# Altium schematic sheet Main PCB.SchDoc
size A4; SheetNumber: 1; SheetTotal: 7
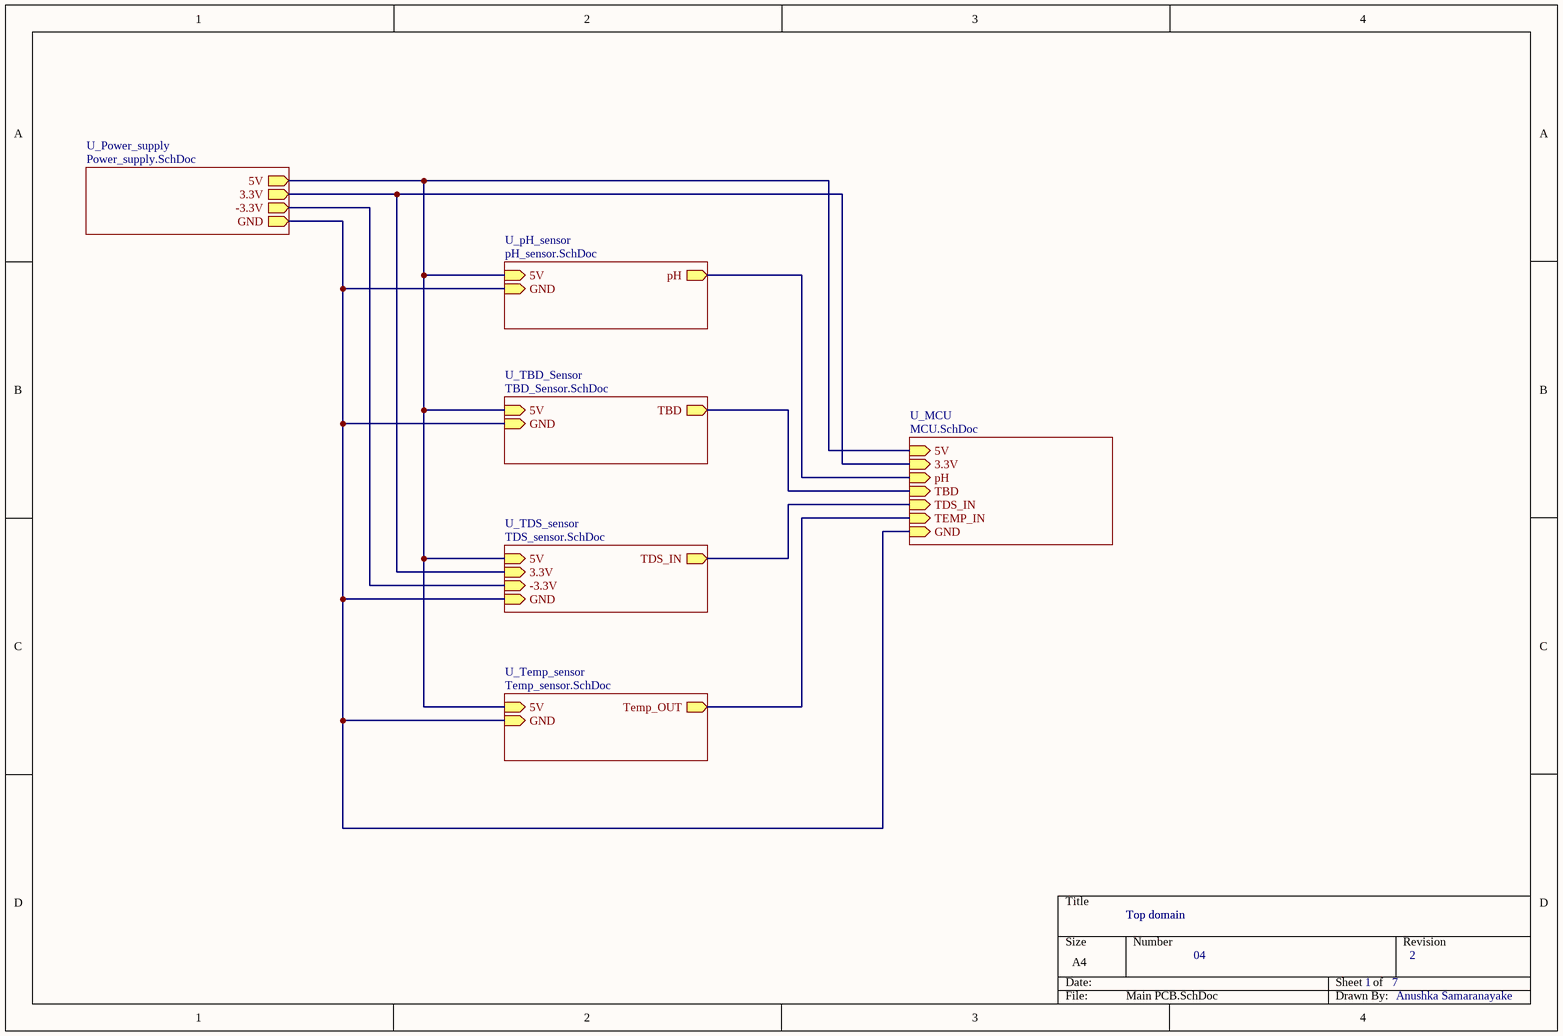
[diagram p0: Main PCB.SchDoc]

## Sub-sheets
U_MCU = MCU.SchDoc: 3.3V (in), GND (in), TEMP_IN (in), TBD (in), TDS_IN (in), pH (in), 5V (in)
U_pH_sensor = pH_sensor.SchDoc: 5V (in), pH (out), GND (in)
U_Power_supply = Power_supply.SchDoc: 5V (out), 3.3V (out), -3.3V (out), GND (out)
U_TBD_Sensor = TBD_Sensor.SchDoc: TBD (out), 5V (in), GND (in)
U_TDS_sensor = TDS_sensor.SchDoc: TDS_IN (out), 3.3V (in), -3.3V (in), 5V (in), GND (in)
U_Temp_sensor = Temp_sensor.SchDoc: Temp_OUT (out), 5V (in), GND (in)

## Nets
(unnamed): sheet U_Power_supply/5V, sheet U_pH_sensor/5V, sheet U_TBD_Sensor/5V, sheet U_TDS_sensor/5V, sheet U_Temp_sensor/5V, sheet U_MCU/5V
(unnamed): sheet U_Power_supply/3.3V, sheet U_TDS_sensor/3.3V, sheet U_MCU/3.3V
(unnamed): sheet U_Power_supply/-3.3V, sheet U_TDS_sensor/-3.3V
(unnamed): sheet U_Power_supply/GND, sheet U_pH_sensor/GND, sheet U_TBD_Sensor/GND, sheet U_TDS_sensor/GND, sheet U_Temp_sensor/GND, sheet U_MCU/GND
(unnamed): sheet U_pH_sensor/pH, sheet U_MCU/pH
(unnamed): sheet U_TBD_Sensor/TBD, sheet U_MCU/TBD
(unnamed): sheet U_TDS_sensor/TDS_IN, sheet U_MCU/TDS_IN
(unnamed): sheet U_Temp_sensor/Temp_OUT, sheet U_MCU/TEMP_IN

## Notes on the sheet
- Top domain
- 04
- 1
- 7
- 2
- Anushka Samaranayake